# EAGLE design business card serial temp (EAGLE 9.3.0)
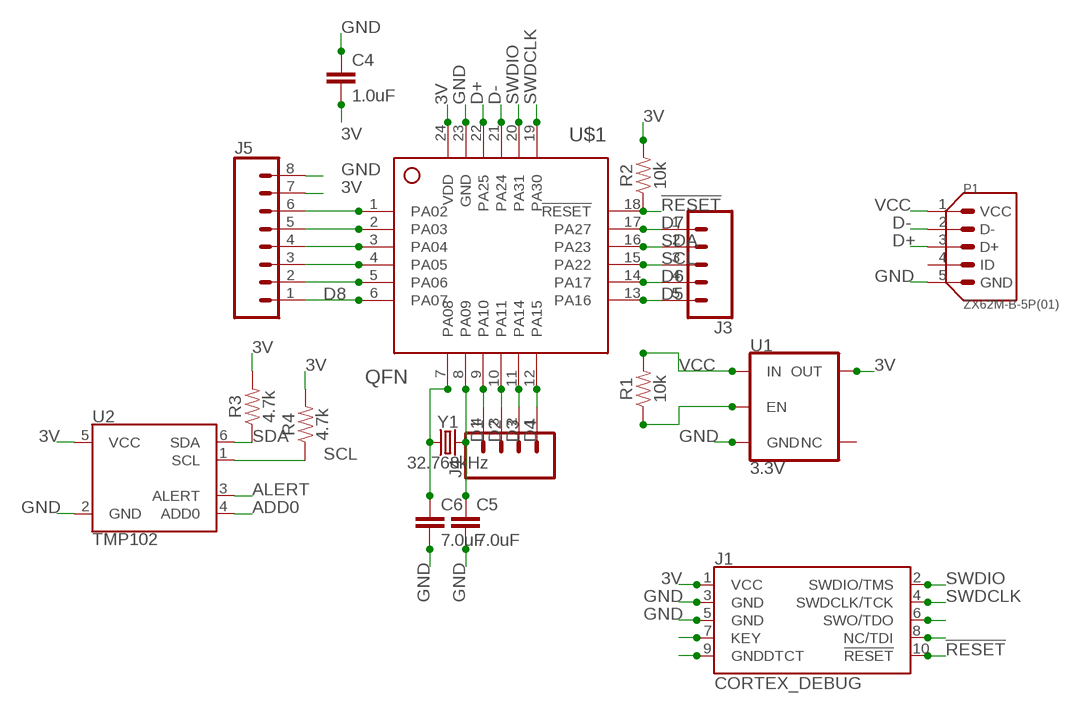
[diagram p0: schematic, sheet 1]

## Parts
C4  1.0uF  1.0UF-0402-16V-10%  [0402]
C5  7.0uF  1.0UF-0402-16V-10%  [0402]
C6  7.0uF  1.0UF-0402-16V-10%  [0402]
J1  CORTEX_DEBUG  CORTEX_DEBUG_PTH  [2X5-PTH-1.27MM]
J3  CONN_05  [1X05]
J4  CONN_04  [1X04]
J5  CONN_08"  [1X08]
P1  ZX62M-B-5P(01)  [HRS_ZX62M-B-5P(01)]
R1  10k  330OHM-0603-1/10W-1%  [0603]
R2  10k  330OHM-0603-1/10W-1%  [0603]
R3  4.7k  330OHM-0603-1/10W-1%  [0603]
R4  4.7k  330OHM-0603-1/10W-1%  [0603]
U1  3.3V  V_REG_AP2112K-3.3V  [SOT23-5]
U2  TMP102  [SOT563]
U$1  QFN  [QFN24-4X4]
Y1  32.768kHz  CRYSTAL-32.768KHZSMD-3.2X1.5  [CRYSTAL-SMD-3.2X1.5MM]

## Nets
3V: C4.2 J1.1(VCC) J5.7 R2.2 R3.2 R4.2 U1.5(OUT) U2.5(VCC) U$1.24(VDD)
!RESET: J1.10(!RESET) R2.1 U$1.18(!RESET)
ADD0: U2.4(ADD0)
ALERT: U2.3(ALERT)
D1: J4.4 U$1.9(PA10)
D2: J4.3 U$1.10(PA11)
D3: J4.2 U$1.11(PA14)
D4: J4.1 U$1.12(PA15)
D5: J3.5 U$1.13(PA16)
D6: J3.4 U$1.14(PA17)
D7: J3.1 U$1.17(PA27)
D8: J5.1 U$1.6(PA07)
D+: P1.3(D+) U$1.22(PA25)
D-: P1.2(D-) U$1.21(PA24)
GND: C4.1 C5.2 C6.2 J1.3(GND) J1.5(GND) J5.8 P1.5(GND) U1.2(GND) U2.2(GND) U$1.23(GND)
N$2: C6.1 U$1.7(PA08) Y1.P$1
N$3: C5.1 U$1.8(PA09) Y1.P$2
N$4: J1.9(GNDDTCT)
N$5: R1.1 U1.3(EN)
N$7: J1.8(NC/TDI)
N$9: J1.7(KEY)
N$10: J1.6(SWO/TDO)
N$21: J5.6 U$1.1(PA02)
N$22: J5.5 U$1.2(PA03)
N$23: J5.4 U$1.3(PA04)
N$24: J5.3 U$1.4(PA05)
N$25: J5.2 U$1.5(PA06)
SCL: J3.3 R4.1 U2.1(SCL) U$1.15(PA22)
SDA: J3.2 R3.1 U2.6(SDA) U$1.16(PA23)
SWDCLK: J1.4(SWDCLK/TCK) U$1.19(PA30)
SWDIO: J1.2(SWDIO/TMS) U$1.20(PA31)
VCC: P1.1(VCC) R1.2 U1.1(IN)
Unconnected: P1.4(ID) U1.4(NC)

## Library data of the parts
C4 = SparkFun-Capacitors:1.0UF: 1µF ceramic capacitors A capacitor is a passive two-terminal electrical component used to store electrical energy temporarily in an electric field.; PROD_ID: CAP-12417
C5 C6 = SparkFun-Capacitors:1.0UF: 1µF ceramic capacitors A capacitor is a passive two-terminal electrical component used to store electrical energy temporarily in an electric field.; PROD_ID: CAP-12417; VALUE: 1.0uF
J1 = SparkFun-Connectors:CORTEX_DEBUG: Cortex Debug Connector - 10 pin Supports JTAG debug, Serial Wire debug, and Serial Wire Viewer. PTH and SMD connector options available. General Connector Information <http://infocenter.arm.com/help/topic/com.arm.doc.faqs/attached/13634/cortex_debug_connectors.pdf> Products: PTH Connector <http://www.digikey.com/product-detail/en/cnc-tech/3220-10-0100-00/1175-1627-ND/3883661> -via Digi-Key SparkFun PSoc <https://www.sparkfun.com/products/13229> SparkFun T <https://www.sparkfun.com/products/13810>
J3 = SparkFun-Connectors:CONN_05: Multi connection point. Often used as Generic Header-pin footprint for 0.1 inch spaced/style header connections On any of the 0.1 inch spaced packages, you can populate with these: Break Away Headers - Straight <https://www.sparkfun.com/products/116> (PRT-00116) Break Away Male Headers - Right Angle <https://www.sparkfun.com/products/553> (PRT-00553) Female Headers <https://www.sparkfun.com/products/115> (PRT-00115) Break Away Headers - Machine Pin <https://www.sparkfun.com/products/117> (PRT-00117) Break Away Female Headers - Swiss Machine Pin <https://www.sparkfun.com/products/743> (PRT-00743) For SCREWTERMINALS and SPRING TERMINALS visit here: Screw Terimnals on SparkFun.com <https://www.sparkfun.com/search/results?term=Screw+Terminals> (5mm/3.5mm/2.54mm spacing) This device is also useful as a general connection point to wire up your design to another part of your project. Our various solder wires solder well into these plated through hole pads. Hook-Up Wire - Assortment (Stranded, 22 AWG) <https://www.sparkfun.com/products/11375> (PRT-11375) Hook-Up Wire - Assortment (Solid Core, 22 AWG) <https://www.sparkfun.com/products/11367> (PRT-11367) View the entire wire category on our website here <https://www.sparkfun.com/categories/141> Special notes: Molex polarized connector foot print use with SKU : PRT-08231 with associated crimp pins and housings. 1MM SMD Version SKU: PRT-10208
J4 = SparkFun-Connectors:CONN_04: Multi connection point. Often used as Generic Header-pin footprint for 0.1 inch spaced/style header connections On any of the 0.1 inch spaced packages, you can populate with these: Break Away Headers - Straight <https://www.sparkfun.com/products/116> (PRT-00116) Break Away Male Headers - Right Angle <https://www.sparkfun.com/products/553> (PRT-00553) Female Headers <https://www.sparkfun.com/products/115> (PRT-00115) Break Away Headers - Machine Pin <https://www.sparkfun.com/products/117> (PRT-00117) Break Away Female Headers - Swiss Machine Pin <https://www.sparkfun.com/products/743> (PRT-00743) For SCREWTERMINALS and SPRING TERMINALS visit here: Screw Terimnals on SparkFun.com <https://www.sparkfun.com/search/results?term=Screw+Terminals> (5mm/3.5mm/2.54mm spacing) This device is also useful as a general connection point to wire up your design to another part of your project. Our various solder wires solder well into these plated through hole pads. Hook-Up Wire - Assortment (Stranded, 22 AWG) <https://www.sparkfun.com/products/11375> (PRT-11375) Hook-Up Wire - Assortment (Solid Core, 22 AWG) <https://www.sparkfun.com/products/11367> (PRT-11367) View the entire wire category on our website here <https://www.sparkfun.com/categories/141> Special notes: Molex polarized connector foot print use with SKU : PRT-08231 with associated crimp pins and housings. 1MM SMD Version SKU: PRT-10208; PROD_ID: CONN-09696
J5 = SparkFun-Connectors:CONN_08: Multi connection point. Often used as Generic Header-pin footprint for 0.1 inch spaced/style header connections On any of the 0.1 inch spaced packages, you can populate with these: Break Away Headers - Straight <https://www.sparkfun.com/products/116> (PRT-00116) Break Away Male Headers - Right Angle <https://www.sparkfun.com/products/553> (PRT-00553) Female Headers <https://www.sparkfun.com/products/115> (PRT-00115) Break Away Headers - Machine Pin <https://www.sparkfun.com/products/117> (PRT-00117) Break Away Female Headers - Swiss Machine Pin <https://www.sparkfun.com/products/743> (PRT-00743) Arduino Stackable Header - 8 Pin <https://www.sparkfun.com/products/9279> (PRT-09279) For SCREWTERMINALS and SPRING TERMINALS visit here: Screw Terimnals on SparkFun.com <https://www.sparkfun.com/search/results?term=Screw+Terminals> (5mm/3.5mm/2.54mm spacing) This device is also useful as a general connection point to wire up your design to another part of your project. Our various solder wires solder well into these plated through hole pads. Hook-Up Wire - Assortment (Stranded, 22 AWG) <https://www.sparkfun.com/products/11375> (PRT-11375) Hook-Up Wire - Assortment (Solid Core, 22 AWG) <https://www.sparkfun.com/products/11367> (PRT-11367) View the entire wire category on our website here <https://www.sparkfun.com/categories/141> Special notes: Molex polarized connector foot print use with SKU : PRT-08231 with associated crimp pins and housings. 1MM SMD Version SKU: PRT-10208 NOTES ON THE VARIANTS LOCK and LOCK_LONGPADS... This footprint was designed to help hold the alignment of a through-hole component (i.e. 6-pin header) while soldering it into place. You may notice that each hole has been shifted either up or down by 0.005 of an inch from it's more standard position (which is a perfectly straight line). This slight alteration caused the pins (the squares in the middle) to touch the edges of the holes. Because they are alternating, it causes a "brace" to hold the component in place. 0.005 has proven to be the perfect amount of "off-center" position when using our standard breakaway headers. Although looks a little odd when you look at the bare footprint, once you have a header in there, the alteration is very hard to notice. Also,if you push a header all the way into place, it is covered up entirely on the bottom side.; PROD_ID: CONN-08438
P1 = ZX62M-B-5P_01_:ZX62M-B-5P(01): Conn Micro USB 2.0 Type B RCP 5 POS 0.65mm Solder RA SMD 5 Terminal 1 Port T/R; AVAILABILITY: Unavailable; DESCRIPTION: Conn Micro USB 2.0 Type B RCP 5 POS 0.65mm Solder RA SMD 5 Terminal 1 Port T/R; MF: Hirose; MP: ZX62M-B-5P_01_; PACKAGE: None; PRICE: None
R1-R4 = SparkFun-Resistors:330OHM: 330Ω resistor A resistor is a passive two-terminal electrical component that implements electrical resistance as a circuit element. Resistors act to reduce current flow, and, at the same time, act to lower voltage levels within circuits. - Wikipedia; PROD_ID: RES-00818; VALUE: 330
U1 = SparkFun-IC-Power:V_REG_AP2112: AP2112 - 600mA CMOS LDO Regulator w/ Enable The AP2112 is CMOS process low dropout linear regulator with enable function, the regulator delivers a guaranteed 600mA (min.) continuous load current. Features Output Voltage Accuracy: ±1.5% Output Current: 600mA (Min.) Foldback Short Current Protection: 50mA Enable Function to Turn ON/OFF VOUT Low Dropout Voltage (3.3V): 250mV (Typ.) @IOUT=600mA Excellent Load Regulation: 0.2%/A (Typ.) Excellent Line Regulation: 0.02%/V (Typ.) Low Quiescent Current: 55μA (Typ.) Low Standby Current: 0.01μA (Typ.) Low Output Noise: 50μVRMS PSRR: 100Hz -65dB, 1kHz -65dB OTSD Protection Stable with 1.0μF Flexible Cap: Ceramic, Tantalum and Aluminum Electrolytic Operation Temperature Range: -40°C to 85°C ESD: MM 400V, HBM 4000V; PROD_ID: VREG-12457
U2 = TMP102:TMP102: Texas Instruments TMP102 Low-Power Digital Temperature Sensor The TMP102 is a digital sensor (I2C a.k.a. TWI), has a resolution of 0.0625°C, and is accurate up to 0.5°C. This is a very handy sensor that requires a very low-current. Datasheet <http://www.sparkfun.com/datasheets/Sensors/Temperature/tmp102.pdf> SparkFun Products SparkFun Digital Temperature Sensor Breakout - TMP102 <https://www.sparkfun.com/products/11931> (SEN-11931); AVAILABILITY: Unavailable; DESCRIPTION: Low Power Digital Temperature Sensor with SMBus/Two-Wire Serial Interface in SOT563; MF: Texas Instruments; MP: TMP102; PACKAGE: None; PRICE: None
U$1 = SAMD11C14:QFN
Y1 = SparkFun-Clocks:CRYSTAL-32.768KHZ: 32.768kHz Crystal Frequency: 32.768kHz Frequency Stability: ±20ppm Load Capacitance: 12.5pF (PTH-2X6 & SMD-3.2X1.5), 6pF (SMD-2X6) SparkFun Products: SparkFun BigTime Watch Kit <https://www.sparkfun.com/products/11734> SparkFun nRF52832 Breakout <https://www.sparkfun.com/products/13990> SparkFun Real Time Clock Module <https://www.sparkfun.com/products/12708>; PROD_ID: XTAL-13062

## Board
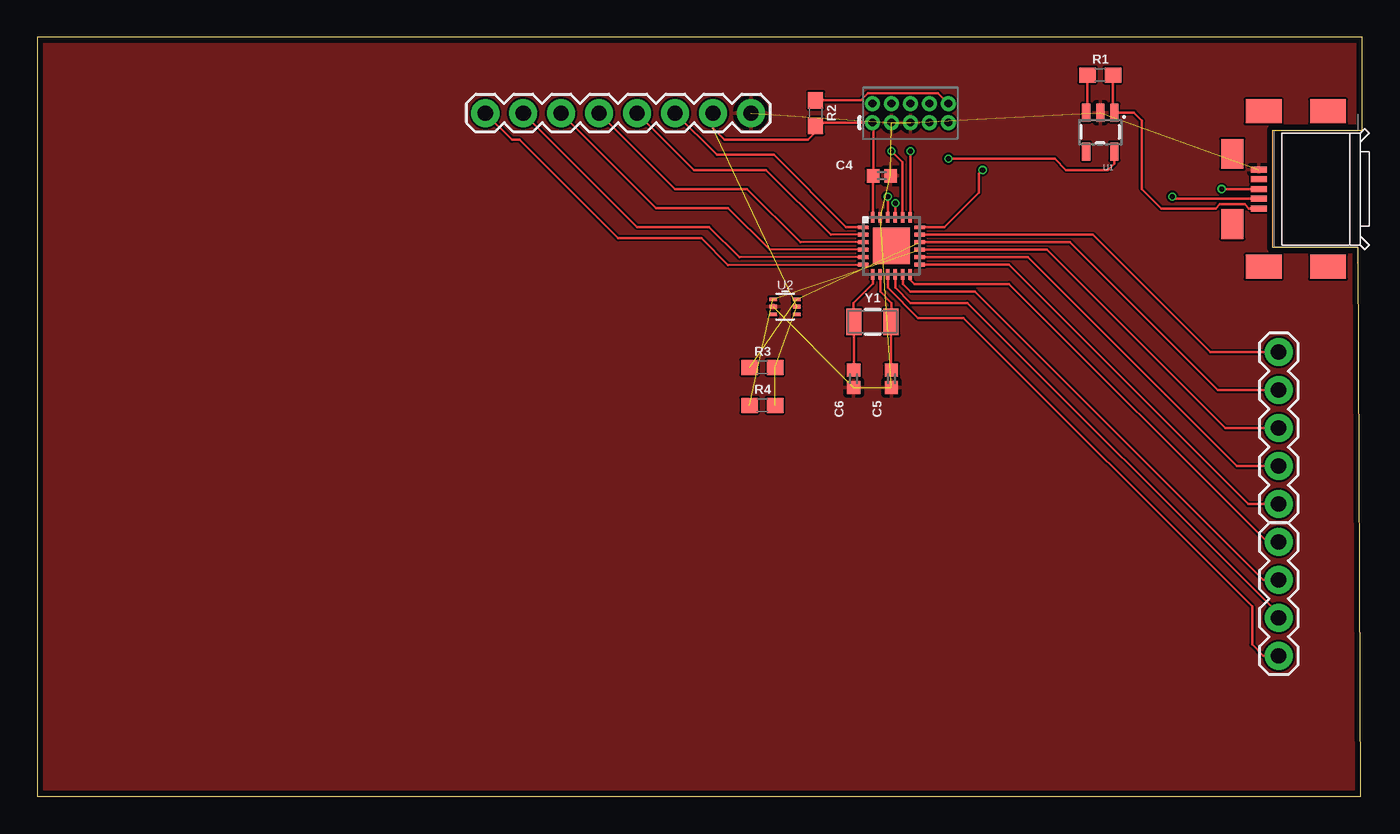
[diagram p1: board, top side]
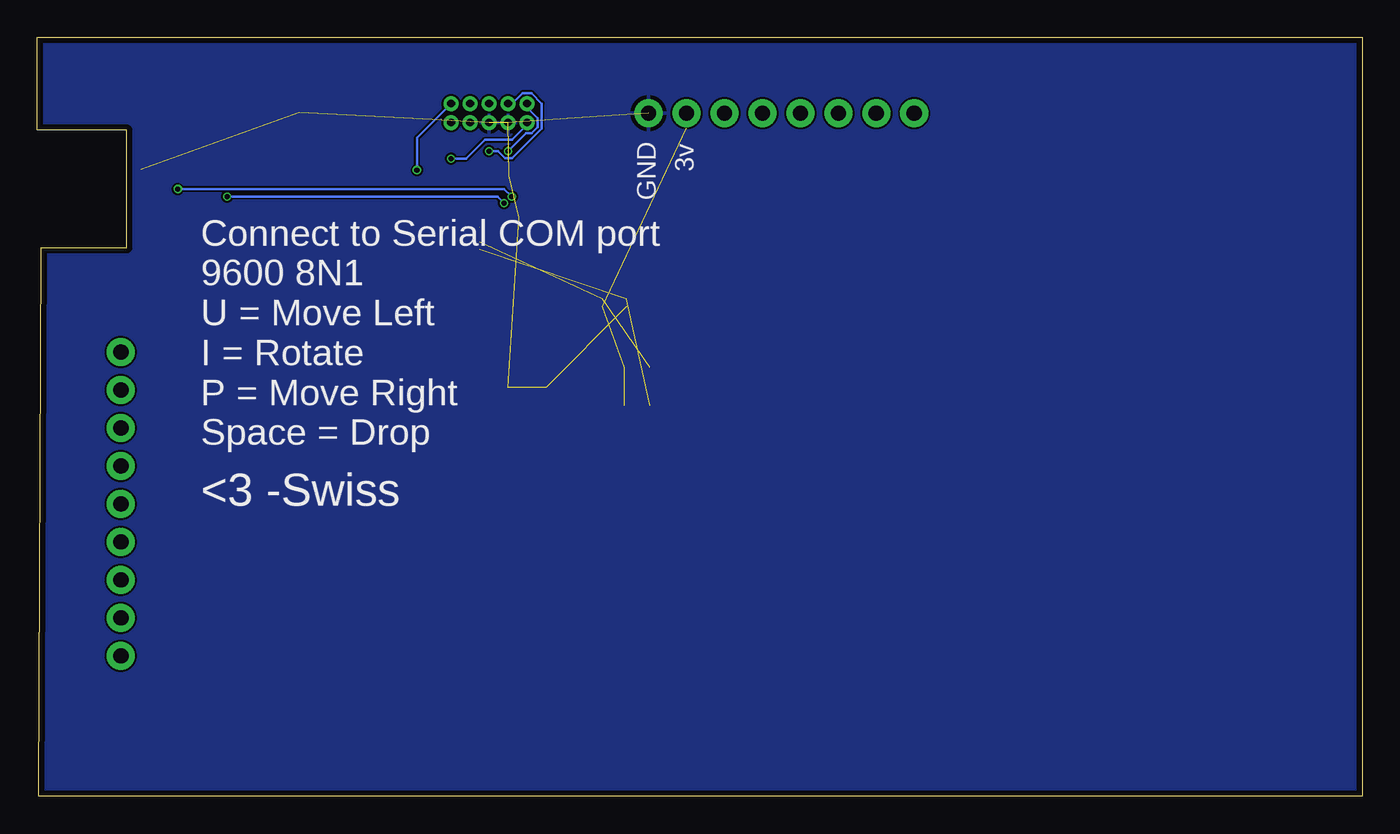
[diagram p2: board, bottom side, seen from below]

Size 88.65 x 50.79 mm. Coordinates in mm from the lower left corner, seen from the top.
Outline: 0,0 88.57,0 88.39,36.58 88.39,36.7 82.68,36.7 82.68,44.58 88.65,44.58 88.65,50.79 0,50.79 0,0
Copper layers (1*16): Top 0.035mm / dielectric 1.5mm / Bottom 0.035mm
Design rules "MF_Standard_2_Layer *": minimum track width 5mil, minimum drill 10mil, track to track 5mil, track to pad 5mil, pad to pad 5mil, via to via 5mil, smd to smd 0mil, copper to edge 15mil, drill to drill 10mil, minimum pad ring 4mil, minimum via ring 4mil, stop-mask expansion 2mil, vias tented up to drill 25mil, thermal gap 10mil

### Footprints (pad centres in the part's own frame; a part is rotated, then mirrored left to right if it is on the bottom)
0402 = smd 0.85 x 0.9: 1 -0.58,0; 2 0.58,0
2X5-PTH-1.27MM = drill 0.508 pad 1: 1 -2.54,-0.635; 2 -2.54,0.635; 3 -1.27,-0.635; 4 -1.27,0.635; 5 0,-0.635; 6 0,0.635; 7 1.27,-0.635; 8 1.27,0.635; 9 2.54,-0.635; 10 2.54,0.635
1X05 = drill 1.016 pad 1.88: 1 0,0; 2 2.54,0; 3 5.08,0; 4 7.62,0; 5 10.16,0
1X04 = drill 1.016 pad 1.88: 1 0,0; 2 2.54,0; 3 5.08,0; 4 7.62,0
1X08 = drill 1.016 pad 1.88: 1 0,0; 2 2.54,0; 3 5.08,0; 4 7.62,0; 5 10.16,0; 6 12.7,0; 7 15.24,0; 8 17.78,0
HRS_ZX62M-B-5P(01) = smd 0.4 x 1.05: 1 -1.3,3.355; 2 -0.65,3.355; 3 0,3.355; 4 0.65,3.355; 5 1.3,3.355 | smd 1.6 x 2.4: S1 5.2,-1.27; S2 -5.2,-1.27; S3 -5.2,3.03; S6 5.2,3.03 | smd 2 x 1.5: S4 -2.35,5.13; S5 2.35,5.13
0603 = smd 1.1 x 1: 1 -0.85,0; 2 0.85,0
SOT23-5 = smd 0.55 x 1.2: 1 -0.95,-1.3; 2 0,-1.3; 3 0.95,-1.3; 4 0.95,1.3; 5 -0.95,1.3
SOT563 = smd 0.508 x 0.249: 1 -0.8,0.498; 2 -0.8,0.003; 3 -0.8,-0.506; 4 0.776,-0.506; 5 0.776,0.003; 6 0.776,0.498
QFN24-4X4 = smd 0.7 x 0.25: 1 -1.9,1.25; 2 -1.9,0.75; 3 -1.9,0.25; 4 -1.9,-0.25; 5 -1.9,-0.75; 6 -1.9,-1.25; 13 1.9,-1.25; 14 1.9,-0.75; 15 1.9,-0.25; 16 1.9,0.25; 17 1.9,0.75; 18 1.9,1.25 | smd 0.25 x 0.7: 7 -1.25,-1.9; 8 -0.75,-1.9; 9 -0.25,-1.9; 10 0.25,-1.9; 11 0.75,-1.9; 12 1.25,-1.9; 19 1.25,1.9; 20 0.75,1.9; 21 0.25,1.9; 22 -0.25,1.9; 23 -0.75,1.9; 24 -1.25,1.9 | smd 2.45 x 2.45: EXP 0,0
CRYSTAL-SMD-3.2X1.5MM = smd 1 x 1.8: P$1 -1.25,0; P$2 1.25,0

### Placement (x,y rotation side)
C4  56.52,41.53 180 top
C5  57.15,27.94 270 top
C6  54.61,27.94 270 top
J1  58.42,45.72 0 top
J3  83.06,29.72 270 top
J4  83.06,17.02 270 top
J5  29.97,45.72 0 top
P1  85.09,40.64 90 top
R1  71.12,48.26 0 top
R2  52.07,45.72 270 top
R3  48.51,28.7 0 top
R4  48.51,26.16 0 top
U1  71.12,44.45 180 top
U2  50.04,32.77 0 top
U$1  57.15,36.83 0 top
Y1  55.88,31.75 0 top

### Tracks (layer width: path | path; a pad name or v marks a point on that pad's centre or on a via)
3V  (via drill 0.35)  (3 unrouted)
  Top 0.152: U$1.24 55.9,41.49 C4.2 55.94,45.03 J1.1 52.28,45.09 R2.2 52.07,44.45 51.56,43.94 45.97,43.94 45.21,44.7 J5.7 | U1.5 72.07,42.35 71.63,41.91 68.83,41.91 68.07,42.67 v60.96,42.67
  Bottom 0.152: v60.96,42.67 59.94,42.67 58.67,43.94 56.9,43.94 55.88,44.96 J1.1
!RESET  (via drill 0.35)  (1 unrouted)
  Top 0.152: R2.1 55.1,46.57 55.59,47.06 60.26,47.06 J1.10 | 59.07,38.1 60.71,38.1 62.99,40.39 62.99,41.66 v63.25,41.91
  Bottom 0.152: v63.25,41.91 63.25,44.07 J1.10
D1
  Top 0.127: 57.02,34.92 U$1.9
  Top 0.152: U$1.9 56.9,34.03 58.93,32 61.98,32 81.28,12.7 81.28,10.16 82.04,9.4 J4.4
D2
  Top 0.127: 57.4,34.67 U$1.10
  Top 0.152: J4.3 83.06,12.19 62.23,33.02 58.42,33.02 57.4,34.04 U$1.10
D3
  Top 0.127: 57.91,34.67 57.91,34.92 U$1.11
  Top 0.152: J4.2 82.04,14.48 62.74,33.78 58.42,33.78 57.91,34.29 57.91,34.67
D4
  Top 0.152: J4.1 82.3,17.02 65.02,34.29 58.67,34.29 58.4,34.56 U$1.12
D5
  Top 0.127: 59.05,35.56 U$1.13
  Top 0.152: U$1.13 65,35.58 81.03,19.56 J3.5
D6
  Top 0.127: 59.05,36.07 U$1.14
  Top 0.152: U$1.14 66.28,36.08 80.26,22.1 J3.4
D7
  Top 0.152: U$1.17 70.62,37.58 78.49,29.72 J3.1
D8
  Top 0.127: 46.23,35.56 55.23,35.56 U$1.6
  Top 0.152: 46.23,35.56 44.45,37.34 38.86,37.34 32.26,43.94 31.75,43.94 J5.1
D+  (via drill 0.35)
  Top 0.152: U$1.22 56.9,39.87 56.9,39.88 v56.9,40.13 | v79.25,40.64 P1.3
  Bottom 0.152: v56.9,40.13 57.4,40.64 v79.25,40.64
D-  (via drill 0.35)
  Top 0.152: U$1.21 57.4,39.37 57.4,39.68 v57.42,39.69 | v75.95,40.13 76.09,39.99 P1.2
  Bottom 0.152: v57.42,39.69 57.86,40.13 v75.95,40.13
GND  (9 unrouted)
  pour Top: 0,50.8 88.9,50.8 88.9,0 0,0
  pour Bottom: 0,50.8 88.9,50.8 88.9,0 0,0
N$2
  Top 0.152: U$1.7 55.9,34.31 54.61,33.02 54.61,31.77 Y1.P$1 54.63,28.54 C6.1
N$3
  Top 0.152: U$1.8 56.4,33.77 57.15,33.02 57.15,31.77 Y1.P$2 57.13,28.54 C5.1
N$5
  Top 0.152: R1.1 70.27,45.85 U1.3
N$21
  Top 0.127: 55.24,38.1 U$1.1
  Top 0.152: U$1.1 54.12,38.08 49.28,42.93 45.47,42.93 J5.6
N$22
  Top 0.127: 53.09,37.59 55.24,37.59 U$1.2
  Top 0.152: 53.09,37.59 48.77,41.91 43.94,41.91 J5.5
N$23
  Top 0.127: 51.05,37.08 U$1.3
  Top 0.152: 51.05,37.08 47.5,40.64 42.67,40.64 J5.4
N$24
  Top 0.127: U$1.4 49.02,36.58
  Top 0.152: 49.02,36.58 46.23,39.37 41.4,39.37 J5.3
N$25
  Top 0.127: U$1.5 55.24,36.07 46.99,36.07
  Top 0.152: 46.99,36.07 44.96,38.1 40.13,38.1 J5.2
SCL  (2 unrouted)
  Top 0.127: U$1.15
  Top 0.152: U$1.15 67.56,36.58 79.5,24.64 J3.3
SDA  (2 unrouted)
  Top 0.152: U$1.16 69.09,37.08 78.99,27.18 J3.2
SWDCLK  (via drill 0.35)
  Top 0.152: U$1.19 58.42,38.75 v58.42,43.18
  Bottom 0.152: v58.42,43.18 57.83,43.18 57.35,42.7 56.88,42.7 54.9,44.68 54.9,46.37 55.59,47.06 56.17,47.06 56.87,46.35 J1.4
SWDIO  (via drill 0.35)
  Top 0.152: U$1.20 57.9,42.43 v57.15,43.18
  Bottom 0.152: v57.15,43.18 55.95,44.38 55.59,44.38 55.18,44.79 55.18,45.38 55.88,46.08 J1.2
VCC
  Top 0.152: R1.2 71.97,45.85 U1.1 73.38,45.75 73.91,45.21 73.91,40.64 75.21,39.34 78.85,39.34 79.13,39.62 80.79,39.62 81.07,39.34 P1.1

### Text on the board
bNames: 3v | GND | Connect to Serial COM port / 9600 8N1 / U = Move Left / I = Rotate / P = Move Right / Space = Drop | <3 -Swiss
tStop: Michael Bales | CEO | Santa Barbara Hackerspace, Inc. | 5782 Thornwood Drive | Goleta, CA 93117 | (805) 242-2533 | mbales@sbhackerspace.com